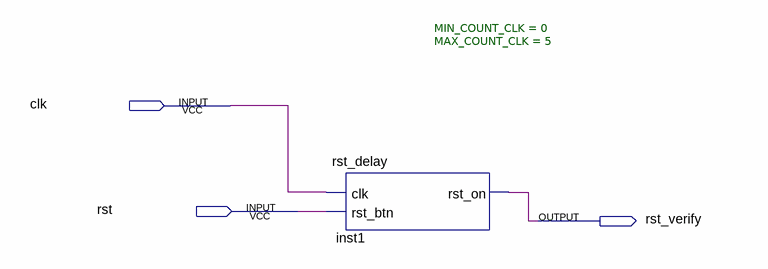
[diagram p0: schematic sheet]
// Quartus schematic rst_delay_test.bdf as structural Verilog: 1 symbols, 3 pins
module rst_delay_test (
  input  clk,
  input  rst,
  output rst_verify
);

  rst_delay #(.MIN_COUNT_CLK(0), .MAX_COUNT_CLK(5)) inst1 (.clk(clk), .rst_btn(rst), .rst_on(rst_verify));
endmodule
